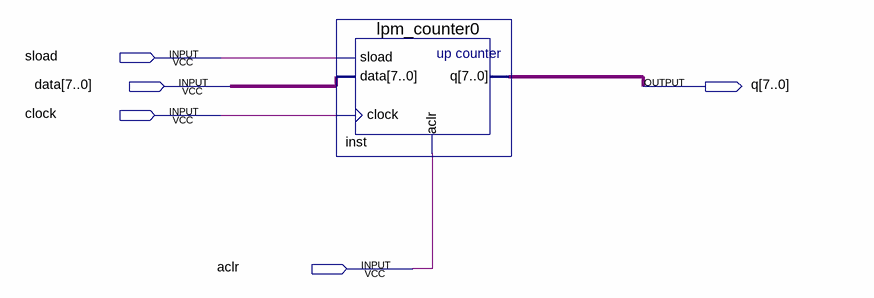
[diagram p0: schematic sheet]
// Quartus schematic counter.bdf as structural Verilog: 1 symbols, 5 pins
module counter (
  input  sload,
  input  [7:0] data,
  input  clock,
  input  aclr,
  output [7:0] q
);

  lpm_counter0 inst (.sload(sload), .data(data), .clock(clock), .aclr(aclr), .q(q));
endmodule
